# EasyEDA Pro project busmaster-v102.eprj, schematic base-board
Board Name: base-board; Create Date: 2025-11-10; Page Name: P1; Project Name: busmaster-v102; Schematic Name: base-board; Update Date: 2026-09-03; Company: EasyEDA.com; Page Size: A4; Version: V1.0
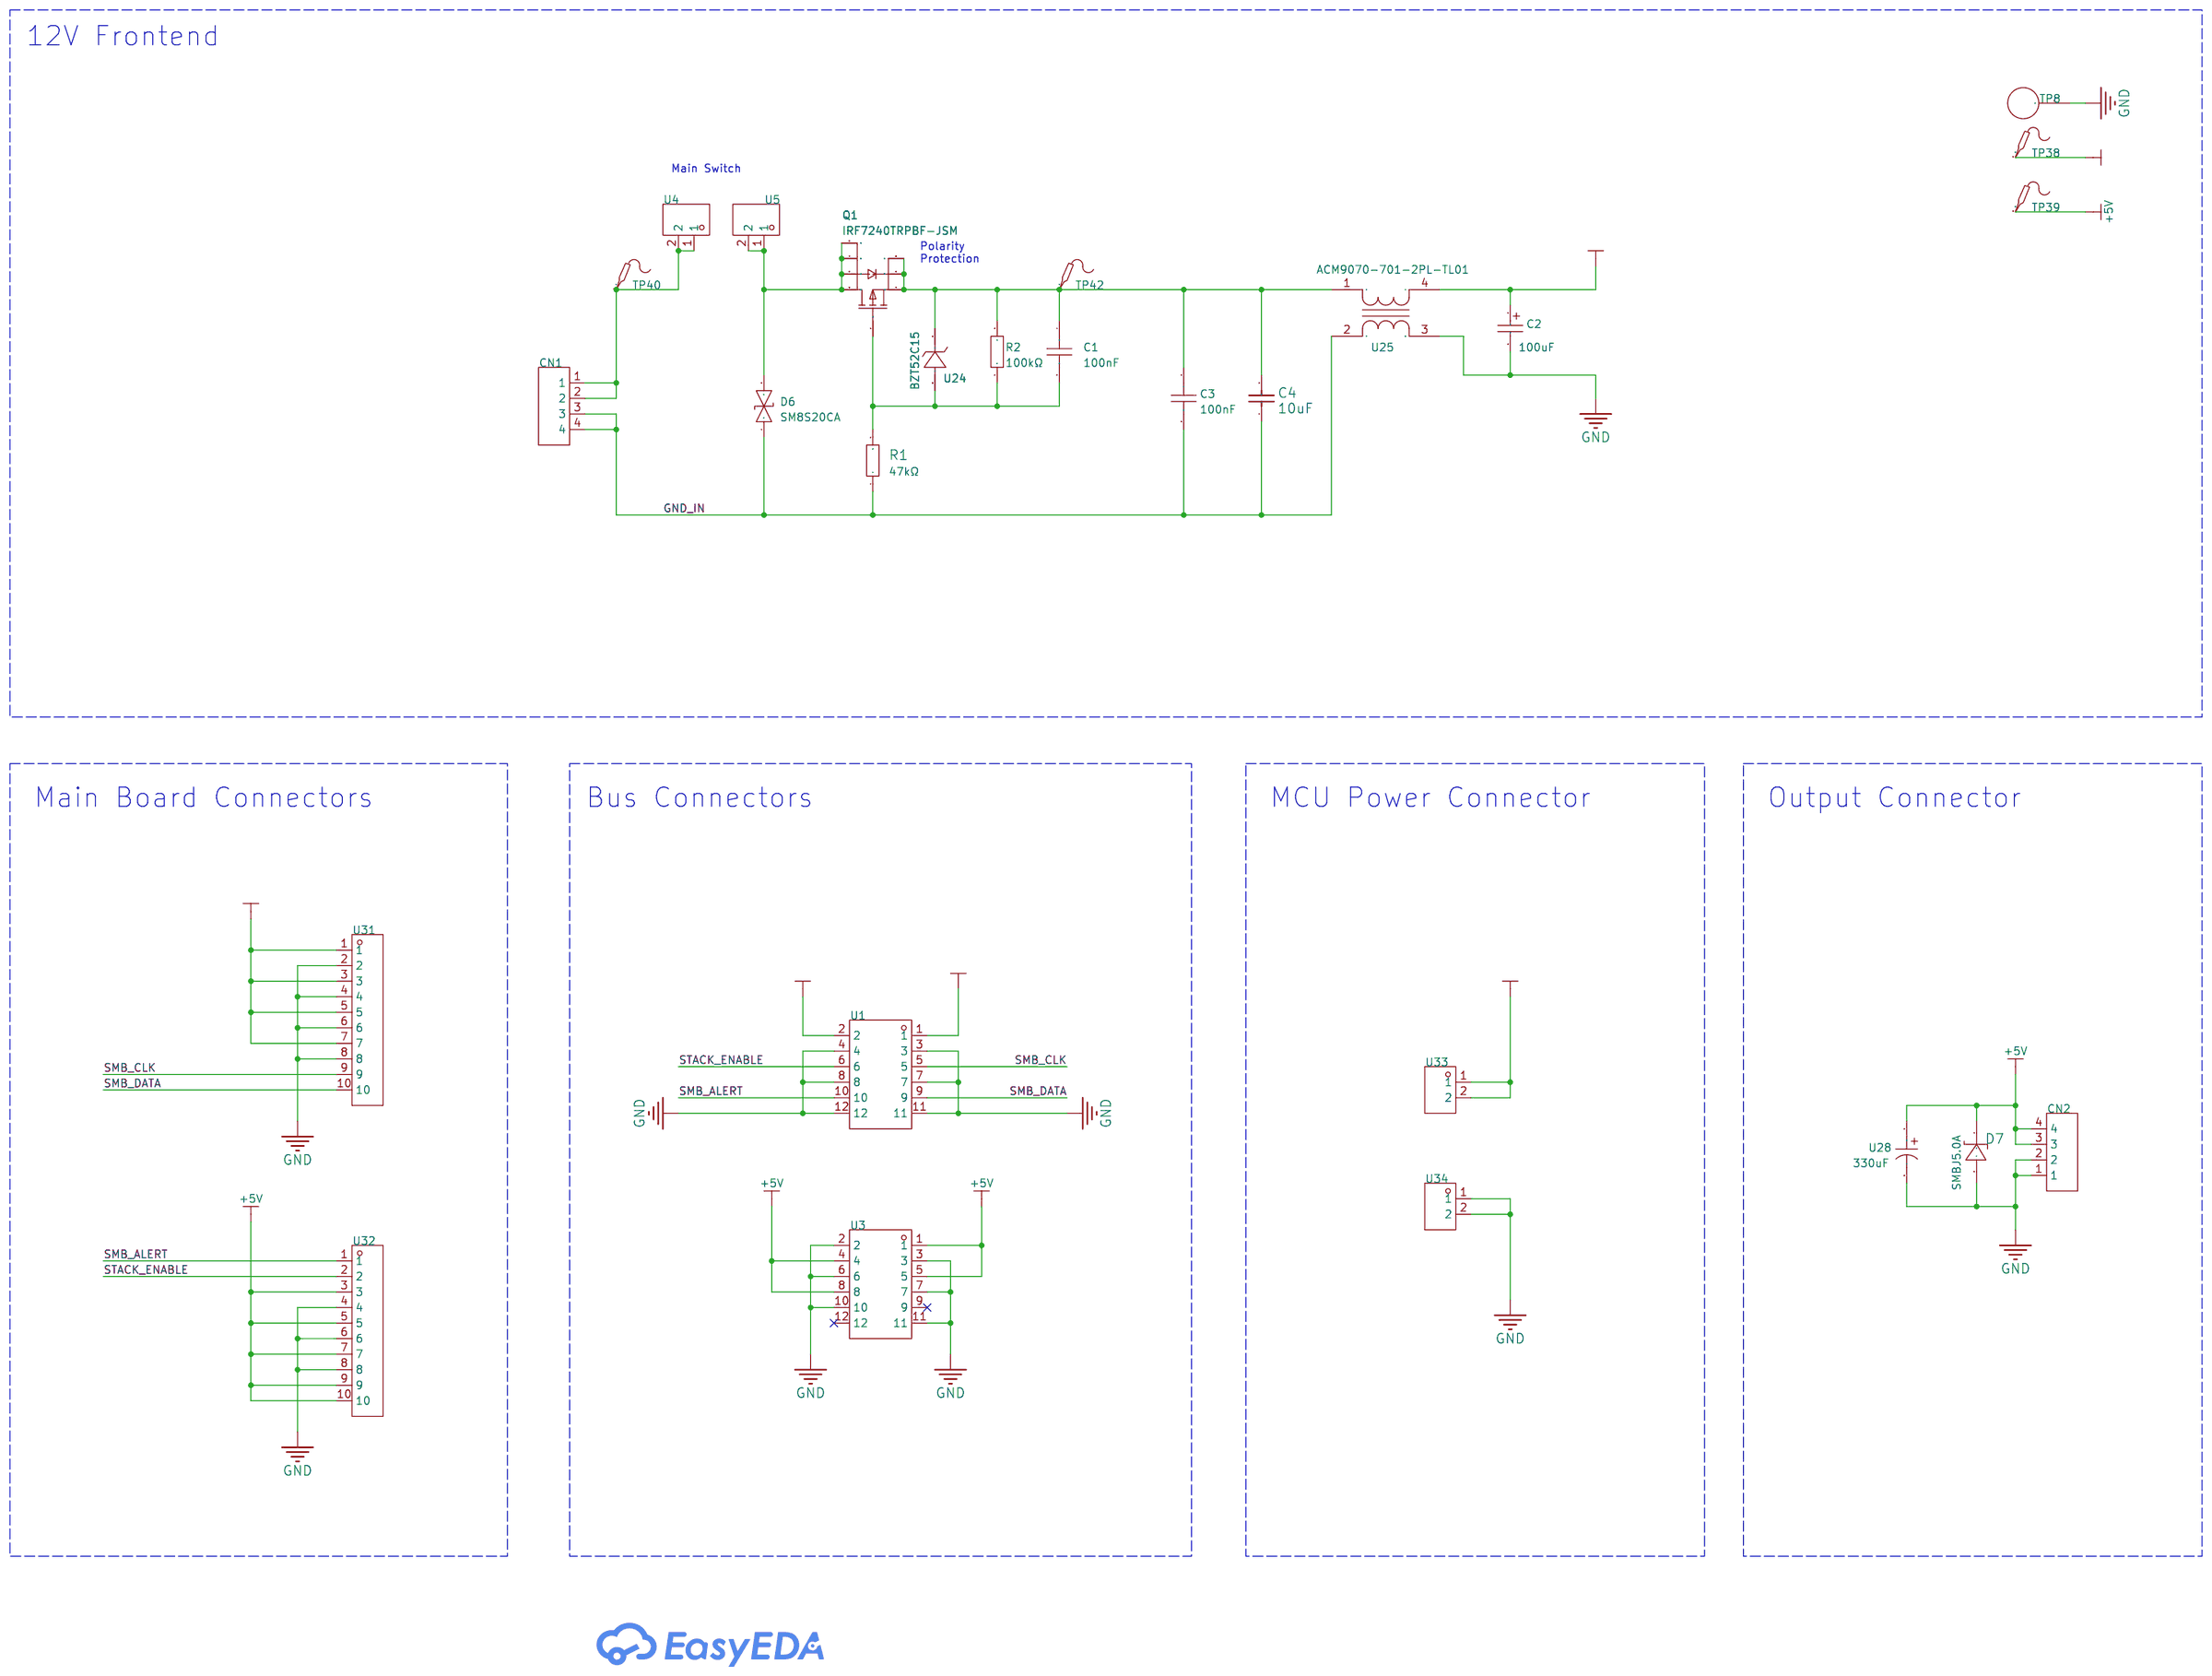
[diagram p1: schematic sheet]

## Parts
C1  100nF  [C0603]
C2  100uF  [CAP-SMD_BD6.3-L6.6-W6.6-LS7.6-RD]
C3  100nF  [C0603]
C4  10uF  [C1206]
CN1  WJ128V-5.0-4P  [CONN-TH_4P-P5.00_WJ128V-4P-5.0-14-00A]
CN2  WJ128V-5.0-4P  [CONN-TH_4P-P5.00_WJ128V-4P-5.0-14-00A]
D6  SM8S20CA  [DO-218AB_L13.5-W8.4-LS15.5-BI]
D7  SMBJ5.0A  [SMB_L4.6-W3.6-LS5.3-RD]
Q1  IRF7240TRPBF-JSM  [SOIC-8_L4.9-W4.0-P1.27-LS6.0-BL]
R1  47kΩ  [R0603]
R2  100kΩ  [R0603]
TP8  RH-5004  [TESTPOINT_TH_BD2.5-D1.2]
TP38  -  [Test-Point-0.5mm]
TP39  -  [Test-Point-0.5mm]
TP40  -  [Test-Point-0.5mm]
TP42  -  [Test-Point-0.5mm]
U1  2005FV-2x6P  [HDR-TH_12P-P2.00-V-F-R2-C6-S2.00]
U3  2005FV-2x6P  [HDR-TH_12P-P2.00-V-F-R2-C6-S2.00]
U4  G630-09-3T  [CONN-TH_2P-L8.2-W0.8-P5.10]
U5  G630-09-3T  [CONN-TH_2P-L8.2-W0.8-P5.10]
U24  BZT52C15  [SOD-123_L2.7-W1.6-LS3.8-RD]
U25  ACM9070-701-2PL-TL01  [FILTER-SMD_4P-L9.0-W7.0-TL]
U28  330uF  [CAP-SMD_BD6.3-L6.6-W6.6-LS7.4-FD]
U31  PM254-1-10-Z-8.5  [HDR-TH_10P-P2.54-V-F]
U32  PM254-1-10-Z-8.5  [HDR-TH_10P-P2.54-V-F]
U33  G630-09-3T  [CONN-TH_2P-L8.2-W0.8-P5.10]
U34  G630-09-3T  [CONN-TH_2P-L8.2-W0.8-P5.10]

## Library data of the parts
C1 C3 = CC0603KRX7R9BB104: Capacitance:100nF Tolerance:±10% Tolerance:±10% Voltage Rating:50V Temperature Coefficient:X7R; LCSC Part Name: 100nF ±10% 50V; Supplier Part: C14663; Manufacturer: YAGEO(国巨); Supplier Footprint: 0603; JLCPCB Part Class: Basic Part; Datasheet: https://item.szlcsc.com/datasheet/CC0603KRX7R9BB104/15331.html; Supplier: LCSC; Tolerance: ±10%; Voltage Rating: 50V; Temperature Coefficient: X7R
C2 = RVT1H101M0607: Capacitance: Tolerance:±20% Tolerance:±20% Voltage Rating: Ripple Current:229mA@120Hz Diameter: Height - Seated (Max): Lifetime: Operating Temperature:-40℃~+105℃ Operating Temperature:-40℃~+105℃; LCSC Part Name: 100uF ±20% 50V; Supplier Part: C3151829; Manufacturer: ROQANG(容强); Supplier Footprint: SMD,D6.3xL7.7mm; JLCPCB Part Class: Extended Part; Datasheet: https://atta.szlcsc.com/upload/public/pdf/source/20170325/1490427950282.pdf; Supplier: LCSC; Tolerance: ±20%; Ripple Current: 229mA@120Hz; Operating Temperature: -40℃~+105℃
C4 = CL31A106KBHNNNE: LCSC Part Name: 10uF ±10% 50V; Supplier Part: C13585; Manufacturer: SAMSUNG(三星); Supplier Footprint: 1206; Datasheet: https://item.szlcsc.com/datasheet/CL31A106KBHNNNE/14236.html; Supplier: LCSC; Tolerance: ±10%; Voltage Rating: 50V; Temperature Coefficient: X5R
CN1 CN2 = WJ128V-5.0-4P: Number of Positions or Pins:1x4P Pitch:5mm Color:Green Mounting Type:Through Hole Number of Pins:4P Number of Rows:1 Number of PINs Per Row:4 Current Rating:20A Voltage Rating (Max):250V Wire Gauge - AWG:12~22 Wire Gauge - AWG:12~22 Wire Gauge - mm2:2.5 W; LCSC Part Name: 5mm 1x4P 排数:1 每排P数:4 直插; Supplier Part: C192769; Manufacturer: KANGNEX(康奈克斯电气); Supplier Footprint: 插件,P=5mm; JLCPCB Part Class: Extended Part; Datasheet: https://item.szlcsc.com/datasheet/WJ128V-5.0-4P/225152.html; Supplier: LCSC; Number of Positions or Pins: 1x4P; Pitch: 5mm; Color: Green; Mounting Type: Through Hole; Number of Pins: 4P; Number of Rows: 1; Number of PINs Per Row: 4; Current Rating: 20A; Voltage Rating (Max): 250V; Wire Gauge - AWG: 12~22; Wire Gauge - mm2: 2.5; Operating Temperature: -40℃~+105℃
D6 = SM8S20CA: Reverse Stand-Off Voltage (Vrwm):20V Maximum Clamping Voltage:32.4V Peak Pulse Current (Ipp)@10/1000us:204A Breakdown Voltage:22.2V Reverse Leakage Current (Ir):150uA Type:TVS; LCSC Part Name: 双向TVS 20V截止 204A峰值脉冲; Supplier Part: C557519; Manufacturer: DOWO(东沃); Supplier Footprint: DO-218AB; JLCPCB Part Class: Extended Part; Datasheet: https://atta.szlcsc.com/upload/public/pdf/source/20200521/C557515_E6C167C5FE746524E8964280E01514FD.pdf; Supplier: LCSC; Reverse Stand-Off Voltage (Vrwm): 20V; Maximum Clamping Voltage: 32.4V; Peak Pulse Current (Ipp)@10/1000us: 204A; Breakdown Voltage: 22.2V; Reverse Leakage Current (Ir): 150uA; Type: TVS
D7 = SMBJ5.0A_C10204: LCSC Part Name: 单向TVS 5V截止 峰值浪涌电流：65.3A@10/1000us; Supplier Part: C10204; Manufacturer: RUILON(瑞隆源); Supplier Footprint: DO-214AA(SMB); JLCPCB Part Class: Extended Part; Datasheet: https://item.szlcsc.com/datasheet/SMBJ5.0A/10744.html; Supplier: LCSC; Polarity: Unidirectional; Reverse Stand-Off Voltage (Vrwm): 5V; Clamping Voltage: 9.2V; Peak Pulse Current (Ipp): 65.3A@10/1000us; Peak Pulse Power Dissipation (Ppp): 600W@10/1000us; Voltage - Breakdown: 7.25V; Reverse Leakage Current (Ir): 800uA; Operating Temperature: -55℃~+150℃; level of protection: IEC 61000-4-4；IEC 61000-4-2; Type: TVS
Q1 = IRF7240TRPBF-JSM: LCSC Part Name: 1个P沟道 耐压:40V 电流:12A; Supplier Part: C18190856; Manufacturer: JSMSEMI(杰盛微); Supplier Footprint: SOP-8; Datasheet: https://item.szlcsc.com/datasheet/IRF7240TRPBF-JSM/19339937.html; Supplier: LCSC; Number: 1 P-Channel; Drain to Source Voltage: 40V; Current - Continuous Drain(Id): 12A; RDS(on): 13mΩ@10V; Pd - Power Dissipation: 3.5W; Gate Threshold Voltage (Vgs(th)): 2.5V@250uA; Gate Charge(Qg): 41nC@10V; Input Capacitance(Ciss): 3.799nF@20V; Reverse Transfer Capacitance (Crss@Vds): 288pF@20V; Operating Temperature: -55℃~+150℃; Type: P-Channel
R1 = 0603WAF4702T5E: Type:Thick Film Resistor Resistance:47kΩ Tolerance:±1% Tolerance:±1% Power(Watts):100mW Voltage-Supply(Max):75V Temperature Coefficient:±100ppm/℃ Temperature Coefficient:±100ppm/℃ Operating Temperature:-55℃~+155℃ Operating Temperature:-55℃~+155℃; LCSC Part Name: 47kΩ ±1% 100mW 厚膜电阻; Supplier Part: C25819; Manufacturer: UNI-ROYAL(厚声); Supplier Footprint: 0603; JLCPCB Part Class: Basic Part; Datasheet: https://item.szlcsc.com/datasheet/0603WAF4702T5E/26562.html; Supplier: LCSC; Type: Thick Film Resistor; Tolerance: ±1%; Power(Watts): 100mW; Voltage-Supply(Max): 75V; Temperature Coefficient: ±100ppm/℃; Operating Temperature: -55℃~+155℃
R2 = 0603WAF1003T5E: Type:Thick Film Resistor Resistance:100kΩ Tolerance:±1% Tolerance:±1% Power(Watts):100mW Voltage-Supply(Max):75V Temperature Coefficient:±100ppm/℃ Temperature Coefficient:±100ppm/℃ Operating Temperature:-55℃~+155℃ Operating Temperature:-55℃~+155℃; LCSC Part Name: 100kΩ ±1% 100mW 厚膜电阻; Supplier Part: C25803; Manufacturer: UNI-ROYAL(厚声); Supplier Footprint: 0603; JLCPCB Part Class: Basic Part; Datasheet: https://item.szlcsc.com/datasheet/0603WAF1003T5E/26546.html; Supplier: LCSC; Type: Thick Film Resistor; Tolerance: ±1%; Power(Watts): 100mW; Voltage-Supply(Max): 75V; Temperature Coefficient: ±100ppm/℃; Operating Temperature: -55℃~+155℃
TP8 = RH-5004: Connector Type:Pin type (through board) Plastic Color:Yellow Board Space (Diameter φ/ Length x Width):2.5mm; LCSC Part Name: PCB电路板测试点/测试针; Supplier Part: C5199804; Manufacturer: 荣和; JLCPCB Part Class: Extended Part; Supplier: LCSC; Connector Type: Pin type (through board); Plastic Color: Yellow; Board Space (Diameter φ/ Length x Width): 2.5mm
TP38-TP40 TP42 = Test-Point
U1 U3 = 2005FV-2x6P: Holes Structure:2x6P Pitch:2mm Row Spacing:2mm Circular Hole / Square Hole:Square Hole Mounting Type:Through Hole Number of Rows:2 Number of Positions:12P Current Rating:2A Holes Direction:Top Insulation Height:4.3mm Operating Temperature:-40℃~+105℃ Opera; LCSC Part Name: 间距:2mm 2x6P 直插; Supplier Part: C18723068; Manufacturer: HanElectricity(瀚源); Supplier Footprint: 插件,P=2mm; JLCPCB Part Class: Extended Part; Datasheet: https://item.szlcsc.com/datasheet/2005FV-2x6P/19915672.html; Supplier: LCSC; Holes Structure: 2x6P; Pitch: 2mm; Row Spacing: 2mm; Circular Hole / Square Hole: Square Hole; Mounting Type: Through Hole; Number of Rows: 2; Number of Positions: 12P; Current Rating: 2A; Holes Direction: Top; Insulation Height: 4.3mm; Operating Temperature: -40℃~+105℃
U4 U5 U33 U34 = G630-09-3T: LCSC Part Name: 6.3mmPCB焊接端子-插片; Supplier Part: C27636945; Manufacturer: SAMZO(三佐); Supplier Footprint: 插件; JLCPCB Part Class: Extended Part; Datasheet: https://item.szlcsc.com/datasheet/G630-09-3T/29374908.html; Supplier: LCSC
U24 = BZT52C15_C2932746: LCSC Part Name: 齐纳二极管 15V 0.5W; Supplier Part: C2932746; Manufacturer: GOODWORK(固得沃克); Supplier Footprint: SOD-123; JLCPCB Part Class: Extended Part; Datasheet: https://item.szlcsc.com/datasheet/BZT52C15/3278303.html; Supplier: LCSC; Diode Configuration: Independent; Zener Voltage(Nom): 15V; Reverse Leakage Current (Ir): 100nA@10.5V; Zener Voltage(Range): 13.8V~15.6V; Pd - Power Dissipation: 500mW; Impedance(Zzt): 30Ω; Impedance(Zzk): 200Ω
U25 = ACM9070-701-2PL-TL01: LCSC Part Name: 两路 共模滤波器 阻抗700Ω@100MHz; Supplier Part: C14594; Manufacturer: TDK; Supplier Footprint: SMD-4P,9x7mm; JLCPCB Part Class: Extended Part; Datasheet: https://item.szlcsc.com/datasheet/ACM9070-701-2PL-TL01/15260.html; Supplier: LCSC; Number of Lines: 2; Current Rating: 5A; Voltage Rating - DC: 80V; Impedance @ Frequency: 700Ω@100MHz; DC Resistance(DCR): 10mΩ; Operating Temperature: -40℃~+85℃
U28 = HV1A337M0607PZ: LCSC Part Name: 330uF ±20% 10V; Supplier Part: C5246515; Manufacturer: HONOR(荣誉); Supplier Footprint: SMD,D6.3xL7.7mm; JLCPCB Part Class: Extended Part; Datasheet: https://item.szlcsc.com/datasheet/HV1A337M0607PZ/5957408.html; Supplier: LCSC; Tolerance: ±20%; Voltage Rating: 10V; Pin Spacing: 2.2mm; Diameter: 6.3mm; Height - Seated (Max): 7.7mm; Lifetime: 2000hrs; Operating Temperature: -55℃~+105℃
U31 U32 = PM254-1-10-Z-8.5: LCSC Part Name: 1x10P 间距:2.54mm 直插; Supplier Part: C2897373; Manufacturer: HCTL(华灿天禄); Supplier Footprint: 插件,P=2.54mm; JLCPCB Part Class: Extended Part; Datasheet: https://item.szlcsc.com/datasheet/PM254-1-10-Z-8.5/3142378.html; Supplier: LCSC; Holes Structure: 1x10P; Pitch: 2.54mm; Circular Hole / Square Hole: Square Hole; Mounting Type: Through Hole; Number of Rows: 1; Number of Positions: 10P; Current Rating: 3A; Holes Direction: Top; Insulation Height: 8.5mm; Contact Material: Copper Alloy; Operating Temperature: -40℃~+105℃

## Nets
+5V: CN2.3 CN2.4 D7.1(K) TP39.1 U3.1 U3.4 U3.5 U3.8 U28.1 U32.3 U32.5 U32.7 U32.9 U32.10
+12V: C2.1 TP38.1 U1.1 U1.2 U25.4 U31.1 U31.3 U31.5 U31.7 U33.1 U33.2
GND: C2.2 CN2.1 CN2.2 D7.2(A) TP8.1 U1.3 U1.4 U1.7 U1.8 U1.11 U1.12 U3.2 U3.3 U3.6 U3.7 U3.10 U3.11 U25.3 U28.2 U31.2 U31.4 U31.6 U31.8 U32.4 U32.6 U32.8 U34.1 U34.2
GND_IN: C3.2 C4.1 CN1.3 CN1.4 D6.1 R1.1 U25.2
SMB_ALERT: U1.10 U32.1
SMB_CLK: U1.5 U31.9
SMB_DATA: U1.9 U31.10
STACK_ENABLE: U1.6 U32.2
$1N44887: CN1.1 CN1.2 TP40.1 U4.1 U4.2
$1N45787: D6.2 Q1.5(D) Q1.6(D) Q1.7(D) Q1.8(D) U5.1 U5.2
$1N46667: C1.2 Q1.4(G) R1.2 R2.1 U24.2(A)
$1N61426: C1.1 C3.1 C4.2 Q1.1(S) Q1.2(S) Q1.3(S) R2.2 TP42.1 U24.1(K) U25.1

Not connected (* = marked no-connect by the designer): U3 9* 12*

## Notes on the sheet
- 12V Frontend
- Main Switch
- Polarity
  Protection
- Main Board Connectors
- Bus Connectors
- MCU Power Connector
- Output Connector
